# EasyEDA Pro project PC20230001.eprj

# Schematic Schematic
Create Date: 2023-11-23; Page Name: P1; Project Name: PC20230001; Schematic Name: Schematic; Update Date: 2023-12-27; Company: Alencar Tecnologia da Amazônia LTDA.; Drawed: Márcio Alencar; Page Size: A4; Part Number: JLCPCB-001; Reviewed: Juan Colonna; Version: V3.0
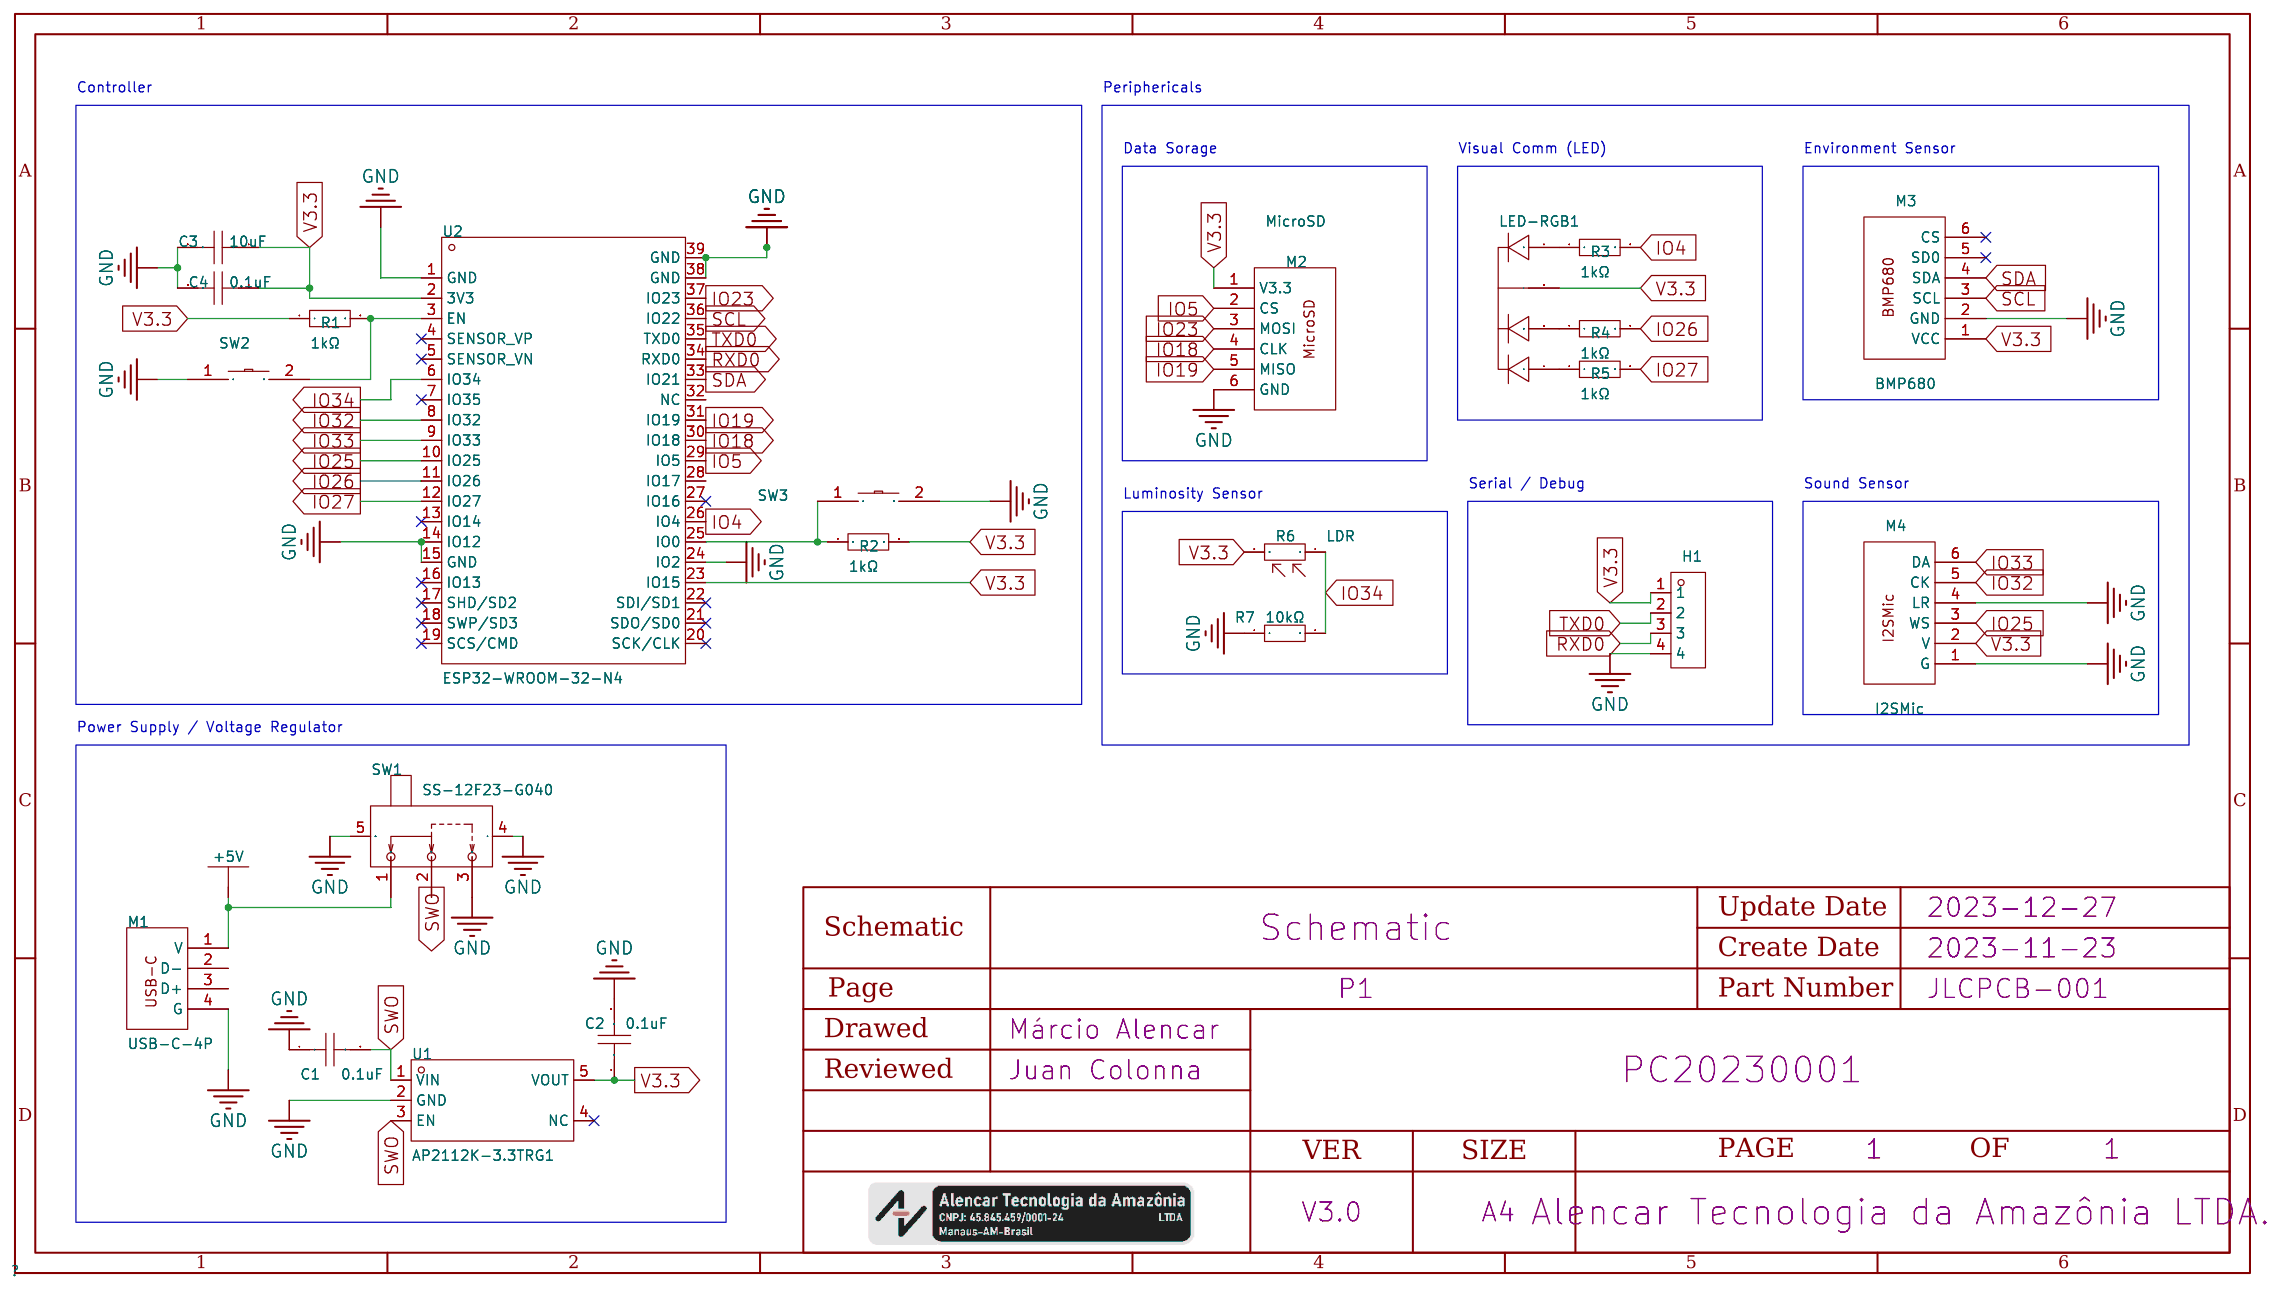
[diagram p0: schematic sheet]

## Parts
C1  0.1uF  [C0805]
C2  0.1uF  [C0805]
C3  10uF  [C0805]
C4  0.1uF  [C0805]
H1  -  [HDR-TH_4P-P2.54-V-F]
LED-RGB1  LED-RGB 共阴 插件 直径5mm  [LED-TH_4P-BD5.8-P1.30]
M1  USB-C-4P  [USB-C-4P_SMD]
M2  MicroSD  [MicroSD_SMD]
M3  BMP680  [BMP680_SMD]
M4  I2SMic  [I2SMic_SMD]
R1  1kΩ  [RES-TH_BD1.8-L3.2-P7.20-D0.4]
R2  1kΩ  [RES-TH_BD1.8-L3.2-P7.20-D0.4]
R3  1kΩ  [RES-TH_BD1.8-L3.2-P7.20-D0.4]
R4  1kΩ  [RES-TH_BD1.8-L3.2-P7.20-D0.4]
R5  1kΩ  [RES-TH_BD1.8-L3.2-P7.20-D0.4]
R6  LDR  [RES-TH_L7.0-W5.9-P5.00-D0.5]
R7  10kΩ  [RES-TH_BD1.8-L3.2-P7.20-D0.4]
SW1  SS-12F23-G040  [SW-TH_SS-12F23-G040]
SW2  TS-1101-C-W  [SW-SMD_L6.0-W3.3-LS8.0]
SW3  TS-1101-C-W  [SW-SMD_L6.0-W3.3-LS8.0]
U1  AP2112K-3.3TRG1  [SOT-25-5_L2.9-W1.6-P0.95-LS2.8-BL]
U2  ESP32-WROOM-32-N4  [WIFIM-SMD_ESP32-WROOM-32-N4]

## Library data of the parts
C1-C4 = CAP_0805: Supplier Footprint: 0805
H1 = HDR-F_2.54_1x4P: Supplier Footprint: Through
LED-RGB1 = LED-RGB 共阴 插件 直径5mm: Supplier Part: C9900015469; Supplier Footprint: LED_RGB; JLCPCB Part Class: Extended Part; Datasheet: https://atta.szlcsc.comnull; Supplier: LCSC
M1 = USB-C-4P
M2 = MiroSD
M3 = BMP680
M4 = I2SMicrophone
R1-R5 R7 = Res_AXIAL-1/8W: Supplier Footprint: Through
R6 = GL7549: Spectral Peak:- Applied Voltage:- Rise Time:- Fall Time:- Illuminated Resistance @ 10Lux:- Illuminated Resistance @ 10Lux:- Dark Resistance:- Operating Temperature:- Operating Temperature:-; LCSC Part Name: 光敏电阻; Supplier Part: C559384; Manufacturer: JCHL(晶创和立); Supplier Footprint: 插件,P=5mm; JLCPCB Part Class: Extended Part; Datasheet: https://atta.szlcsc.com/upload/public/pdf/source/20200525/C559384_342228AE8878A7B9A17BF0FFA6DF3E3D.pdf; Supplier: LCSC
SW1 = SS-12F23-G040: Current Rating (DC):1A Voltage Rating (DC):24V Circuit:SPDT Mounting Style:Lying Mechanical Life:10000次 Actuator Color:Black Actuator Style:Rectangular columnar Pin Style:PCPin Operating Temperature:-25℃~+70℃ Operating Temperature:-25℃~+70℃ Switch Length:; LCSC Part Name: 柄长4mm 卧插两档 滑动开关; Supplier Part: C2848932; Manufacturer: G-Switch(品赞); Supplier Footprint: 插件; JLCPCB Part Class: Extended Part; Datasheet: https://atta.szlcsc.com/upload/public/pdf/source/20210728/C2848932_6371EF66D27F33FC1DE94FF4D960D2AE.pdf; Supplier: LCSC; Current Rating (DC): 1A; Voltage Rating (DC): 24V; Circuit: SPDT; Mounting Style: Lying; Mechanical Life: 10000次; Actuator Color: Black; Actuator Style: Rectangular columnar; Pin Style: PCPin; Operating Temperature: -25℃~+70℃; Switch Length: 13.2mm; Switch Width: 5.8mm; Switch Height: 10.85mm
SW2 SW3 = TS-1101-C-W: Contact Current:50mA Voltage Rating (AC):- Voltage Rating (DC):12V Power Rating:- Insulation Resistance:- Circuit:SPST Mounting Style:Brick nogging Actuator Style:Rectangle button Actuator/Cap Color:白色带淡绿 With Lamp:No Operating Force:260gf Mechanical Life; LCSC Part Name: 立贴 6*3.6*2.5mm 轻触开关 一型3*6*2.5有白ZD b拉伸白色带淡绿按键 卷装; Supplier Part: C318938; Manufacturer: XKB Connectivity(中国星坤); Supplier Footprint: SMD; JLCPCB Part Class: Extended Part; Datasheet: https://atta.szlcsc.com/upload/public/pdf/source/20200227/C318938_C2E53B1EEDE37D980A33616AC086DE53.pdf; Supplier: LCSC; Contact Current: 50mA; Voltage Rating (DC): 12V; Circuit: SPST; Mounting Style: Brick nogging; Actuator Style: Rectangle button; Actuator/Cap Color: 白色带淡绿; With Lamp: No; Operating Force: 260gf; Mechanical Life: 50000次; Operating Temperature: -30℃~+85℃; Switch Length: 6mm; Switch Width: 3.6mm; Switch Height: 2.5mm; Strike Gundam: NO
U1 = AP2112K-3.3TRG1: Output Type: Output Polarity:Positive Number of Outputs:1 Maximum Input Voltage:6V Output Voltage:3.3V~3.3V Output Voltage:3.3V~3.3V Dropout Voltage:400mV@(600mA) Output Current:600mA Power Supply Rejection Ratio (PSRR):65dB@(100Hz,1kHz); Supplier Part: C51118; Manufacturer: DIODES(美台); Supplier Footprint: SOT-25-5; JLCPCB Part Class: Extended Part; Datasheet: https://atta.szlcsc.com/upload/public/pdf/source/20171221/C51118_15138312998391195590.pdf; Supplier: LCSC; Output Polarity: Positive; Number of Outputs: 1; Maximum Input Voltage: 6V; Output Voltage: 3.3V~3.3V; Dropout Voltage: 400mV@(600mA); Output Current: 600mA; Power Supply Rejection Ratio (PSRR): 65dB@(100Hz,1kHz)
U2 = ESP32-WROOM-32-N4: LCSC Part Name: WiFi+蓝牙4.2+双核CPU模块; Supplier Part: C82899; Manufacturer: ESPRESSIF(乐鑫); Supplier Footprint: SMD,18x25.5mm; JLCPCB Part Class: Extended Part; Datasheet: https://atta.szlcsc.com/upload/public/pdf/source/20210719/C82899_2D52724B6FAFABC419BCF308C5944296.pdf; Supplier: LCSC

## Nets
+5V: M1.1(V) SW1.1
GND: C1.1 C2.2 C3.2 C4.2 H1.4 M1.4(G) M2.6(GND) M3.2(GND) M4.1(G) M4.4(LR) R7.1 SW1.3 SW1.4 SW1.5 SW2.1 SW3.2 U1.2(GND) U2.1(GND) U2.14(IO12) U2.15(GND) U2.24(IO2) U2.38(GND) U2.39(GND)
V3.3: C2.1 C3.1 C4.1 H1.1 LED-RGB1.2(-) M2.1(V3.3) M3.1(VCC) M4.2(V) R1.1 R2.2 R6.2 U1.5(VOUT) U2.2(3V3) U2.23(IO15)
IO4: R3.2 U2.26(IO4)
IO5: M2.2(CS) U2.29(IO5)
IO18: M2.4(CLK) U2.30(IO18)
IO19: M2.5(MISO) U2.31(IO19)
IO23: M2.3(MOSI) U2.37(IO23)
IO25: M4.3(WS) U2.10(IO25)
IO26: R4.2 U2.11(IO26)
IO27: R5.2 U2.12(IO27)
IO32: M4.5(CK) U2.8(IO32)
IO33: M4.6(DA) U2.9(IO33)
IO34: R6.1 R7.2 U2.6(IO34)
RXD0: H1.3 U2.34(RXD0)
SCL: M3.3(SCL) U2.36(IO22)
SDA: M3.4(SDA) U2.33(IO21)
SWO: C1.2 SW1.2 U1.1(VIN) U1.3(EN)
TXD0: H1.2 U2.35(TXD0)
Net-(LED-RGB1-1): LED-RGB1.1 R3.1
Net-(LED-RGB1-3): LED-RGB1.3 R4.1
Net-(LED-RGB1-4): LED-RGB1.4 R5.1
Net-(R1-2): R1.2 SW2.2 U2.3(EN)
Net-(R2-1): R2.1 SW3.1 U2.25(IO0)

Not connected (* = marked no-connect by the designer): M1 2(D-) 3(D+); M3 5(SD0)* 6(CS)*; U1 4(NC)*; U2 4(SENSOR_VP)* 5(SENSOR_VN)* 7(IO35)* 13(IO14)* 16(IO13)* 17(SHD/SD2)* 18(SWP/SD3)* 19(SCS/CMD)* 20(SCK/CLK)* 21(SDO/SD0)* 22(SDI/SD1)* 27(IO16)* 28(IO17) 32(NC)

## Notes on the sheet
- Controller
- Periphericals
- Data Sorage
- Visual Comm (LED)
- Environment Sensor
- Luminosity Sensor
- Serial / Debug
- Sound Sensor
- Power Supply / Voltage Regulator

# Board PCB
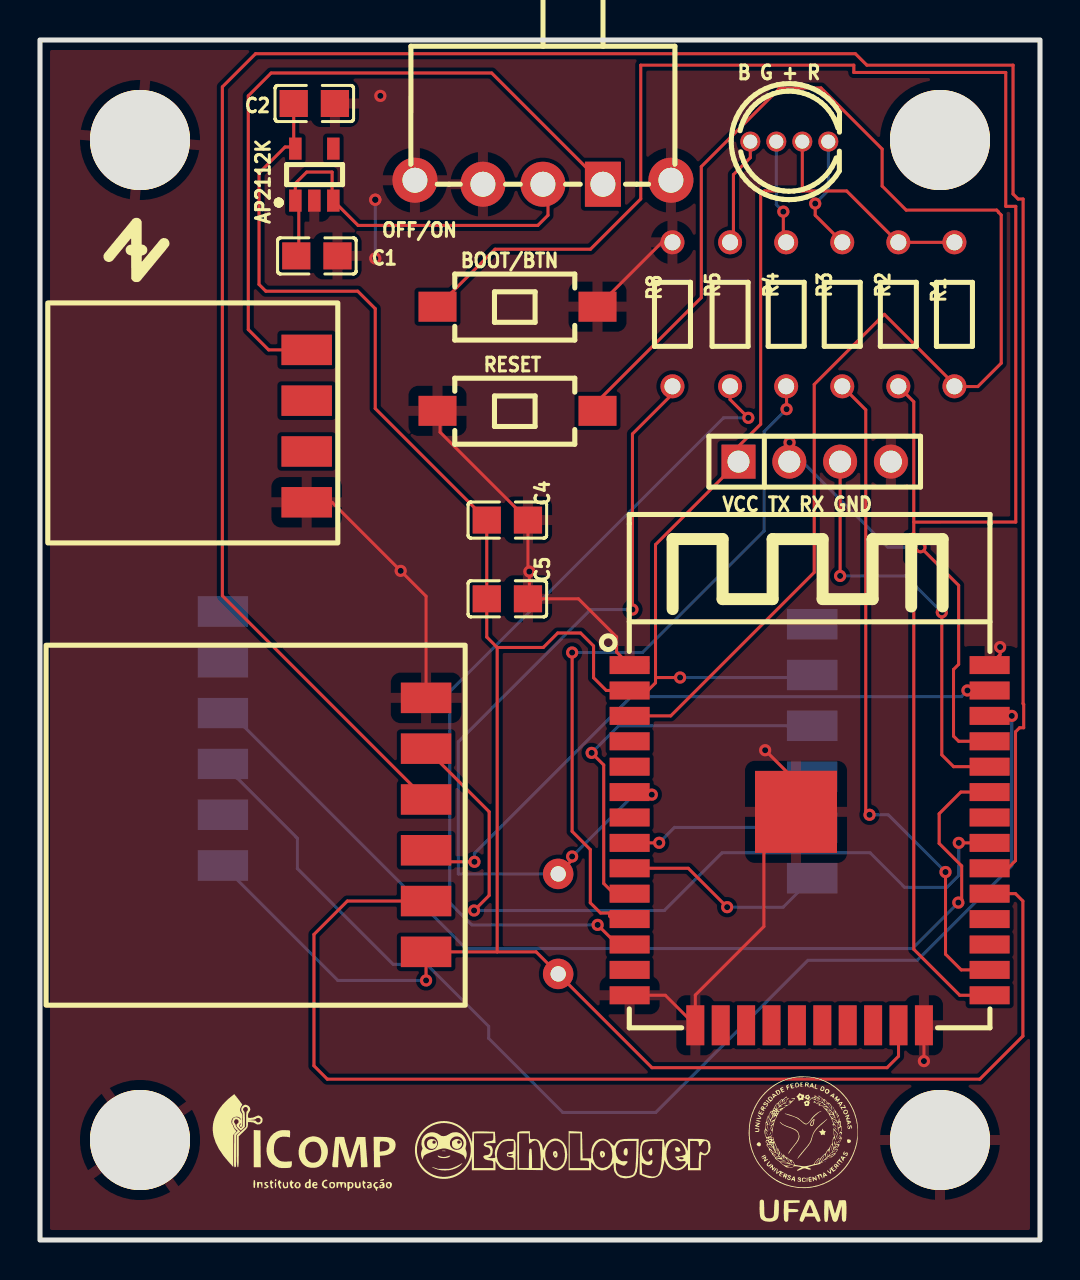
[diagram p1: board, top side]
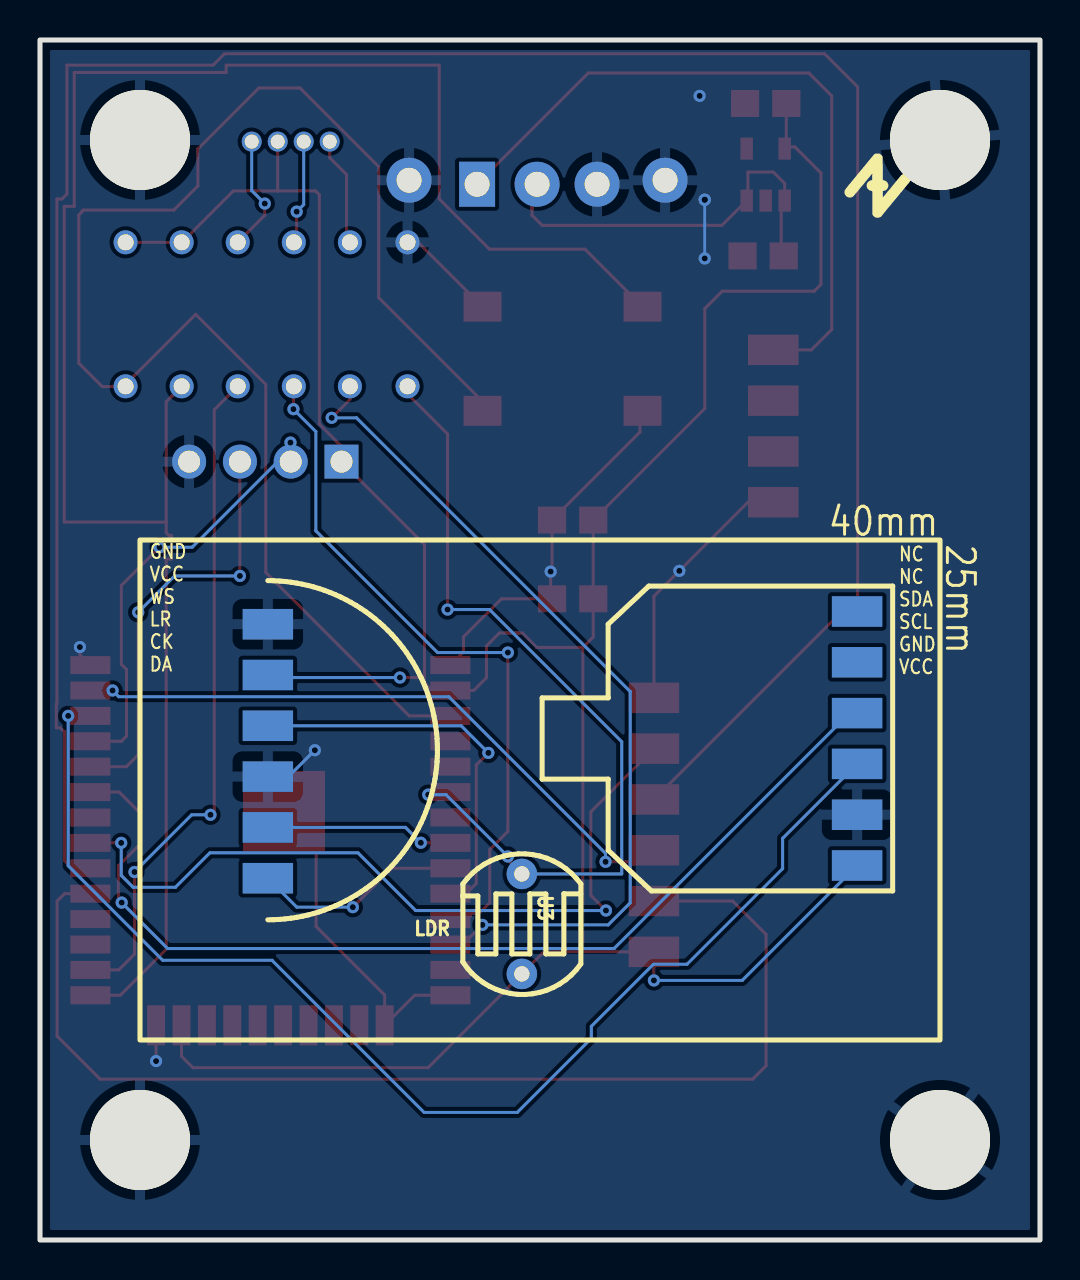
[diagram p2: board, bottom side, seen from below]

Outline 50 x 60 mm; copper layers: Top Layer, Bottom Layer. Coordinates in mm from the lower left corner of the outline.
Outline path: rectangle 0,60 50,0
Stack: Top Layer 0.035mm / Dielectric1 1.51mm FR4 er 4.5 / Bottom Layer 0.035mm

## Design rules (mm)
template: Custom Config
spacing copperThickness1oz (default): track to track 0.102, other pairs 0.152 to 0.3
spacing copperThickness2oz: track to track 0.203, other pairs 0.152 to 0.3
track width copperThickness1oz (default): min 0.152, default 0.152, max 0.152
track width copperThickness2oz: min 0.203, default 0.254, max 2.54
differential pair differentialPair (default): width min 0.127, default 0.254, max 2.54; gap min 0.152, default 0.152
via viaSize (default): diameter min 0.5, default 0.61, max 10; hole min 0.3, default 0.305, max 6.299

## Placement (name value [footprint] x y rotation side)
AP2112K  AP2112K-3.3TRG1  [SOT-25-5_L2.9-W1.6-P0.95-LS2.8-BL]  13.72 53.27 0 top
B G + R  LED-RGB 共阴 插件 直径5mm  [LED-TH_4P-BD5.8-P1.30]  37.47 54.92 0 top
BOOT/BTN  TS-1101-C-W  [SW-SMD_L6.0-W3.3-LS8.0]  23.88 46.67 0 top
C1  0.1uF  [C0805]  13.84 49.2 180 top
C2  0.1uF  [C0805]  13.72 56.83 0 top
C3  10uF  [USB-C-4P_SMD]  9.53 40.7 90 top
C4  0.1uF  [C0805]  23.37 36 0 top
C5  10uF  [C0805]  23.37 32.06 0 top
LDR  GL7549  [RES-TH_L7.0-W5.9-P5.00-D0.5]  25.91 15.8 0 bottom
NOREF  -  [Pad_e140]  45 55 0 top
NOREF#2  -  [Pad_e146]  5 5 305 top
NOREF#3  -  [Pad_e135]  5 55 355 top
NOREF#4  -  [Pad_e145]  45 5 0 top
NOREF#5  -  [I2SMic_SMD]  36.7 24.44 270 bottom
OFF/ON  SS-12F23-G040  [SW-TH_SS-12F23-G040]  25.15 52.89 180 top
R1  1kΩ  [RES-TH_BD1.8-L3.2-P7.20-D0.4]  45.72 46.28 270 top
R2  1kΩ  [RES-TH_BD1.8-L3.2-P7.20-D0.4]  42.92 46.28 90 top
R3  1kΩ  [RES-TH_BD1.8-L3.2-P7.20-D0.4]  40.11 46.28 270 top
R4  1kΩ  [RES-TH_BD1.8-L3.2-P7.20-D0.4]  37.31 46.28 270 top
R5  1kΩ  [RES-TH_BD1.8-L3.2-P7.20-D0.4]  34.5 46.28 270 top
R8  10kΩ  [RES-TH_BD1.8-L3.2-P7.20-D0.4]  31.62 46.28 270 top
RESET  TS-1101-C-W  [SW-SMD_L6.0-W3.3-LS8.0]  23.88 41.46 0 top
U1  AP2112K-3.3TRG1  [WIFIM-SMD_ESP32-WROOM-32-N4]  38.48 19.74 0 top
U3  BMP680  [BMP680_SMD]  12.06 25.08 90 bottom
U4  MicroSD  [MicroSD_SMD]  16.13 20.76 90 top
VCC TX RX GND  -  [HDR-TH_4P-P2.54-V-F]  38.74 38.92 0 top

## Footprints (pads in the part's own frame, mm; a bottom-side part is the same pattern mirrored in y, then rotated)
BMP680_SMD
  rect 1.524x2.524 smd: 1(-6.35,-2.921) 2(-3.81,-2.921) 3(-1.27,-2.921) 4(1.27,-2.921) 5(3.81,-2.921) 6(6.35,-2.921)
C0805
  rect 1.41x1.35 smd: 1(-1.03,0) 2(1.03,0)
HDR-TH_4P-P2.54-V-F
  rect 1.7x1.7 hole 1.1: 1(-3.81,0)
  round 1.7 hole 1.1: 2(-1.27,0) 3(1.27,0) 4(3.81,0)
I2SMic_SMD
  rect 1.524x2.524 smd: 1(-6.35,-1.905) 2(-3.81,-1.905) 3(-1.27,-1.905) 4(1.27,-1.905) 5(3.81,-1.905) 6(6.35,-1.905)
LED-TH_4P-BD5.8-P1.30
  round 1 hole 0.7: 1(1.95,0) 2(0.65,0) 3(-0.65,0) 4(-1.95,0)
MicroSD_SMD
  rect 1.524x2.524 smd: 1(-6.35,-3.175) 2(-3.81,-3.175) 3(-1.27,-3.175) 4(1.27,-3.175) 5(3.81,-3.175) 6(6.35,-3.175)
Pad_e135
  round 5 hole 5: 1(0,0)
Pad_e140
  round 5 hole 5: 1(0,0)
Pad_e145
  round 5 hole 5: 1(0,0)
Pad_e146
  round 5 hole 5: 1(0,0)
RES-TH_BD1.8-L3.2-P7.20-D0.4
  round 1.2 hole 0.8: 1(-3.6,0) 2(3.6,0)
RES-TH_L7.0-W5.9-P5.00-D0.5
  round 1.524 hole 0.762x0.767: 1(0,-2.5) 2(0,2.5)
SOT-25-5_L2.9-W1.6-P0.95-LS2.8-BL
  rect 0.623x1.105 smd: 1(-0.95,-1.3) 2(-0.001,-1.3) 3(0.95,-1.3) 4(0.95,1.3) 5(-0.95,1.3)
SW-SMD_L6.0-W3.3-LS8.0
  rect 1.9x1.5 smd: 1(-4,0) 2(4,0)
SW-TH_SS-12F23-G040
  rect 1.8x2.25 hole 1.25: 1(-3,0.1)
  round 2.25 hole 1.25: 2(0,0.1) 3(3,0.1) 4(6.4,-0.1) 5(-6.4,-0.1)
USB-C-4P_SMD
  rect 1.524x2.524 smd: 1(3.81,-3.81) 2(1.27,-3.81) 3(-1.27,-3.81) 4(-3.81,-3.81)
WIFIM-SMD_ESP32-WROOM-32-N4
  rect 2x0.9 smd: 1(-9,9.005) 2(-9,7.735) 3(-9,6.465) 4(-9,5.195) 5(-9,3.925) 6(-9,2.655) 7(-9,1.385) 8(-9,0.115) 9(-9,-1.155) 10(-9,-2.425) 11(-9,-3.695) 12(-9,-4.965) 13(-9,-6.235) 14(-9,-7.505) 25(9,-7.505) 26(9,-6.235) 27(9,-4.965) 28(9,-3.695) 29(9,-2.425) 30(9,-1.155) 31(9,0.115) 32(9,1.385) 33(9,2.655) 34(9,3.925) 35(9,5.195) 36(9,6.465) 37(9,7.735) 38(9,9.005)
  rect 0.9x2 smd: 15(-5.715,-9.005) 16(-4.445,-9.005) 17(-3.175,-9.005) 18(-1.905,-9.005) 19(-0.635,-9.005) 20(0.635,-9.005) 21(1.905,-9.005) 22(3.175,-9.005) 23(4.445,-9.005) 24(5.715,-9.005)
  rect 4.1x4.1 smd: 39(-0.68,1.665)

## Nets
+5V: C3.1 OFF/ON.1
GND: AP2112K.2 BOOT/BTN.2 C1.1 C2.2 C3.4 C4.2 C5.2 NOREF.1 NOREF#2.1 NOREF#3.1 NOREF#4.1 NOREF#5.1 NOREF#5.4 OFF/ON.3 OFF/ON.4 OFF/ON.5 R8.1 RESET.1 U1.1 U1.14 U1.15 U1.24 U1.38 U1.39 U3.2 U4.6 VCC TX RX GND.4
V3.3: AP2112K.5 B G + R.2 C2.1 C4.1 C5.1 LDR.2 NOREF#5.2 R1.1 R2.2 U1.2 U1.23 U3.1 U4.1 VCC TX RX GND.1
IO4: R3.2 U1.26
IO5: U1.29 U4.2
IO18: U1.30 U4.4
IO19: U1.31 U4.5
IO23: U1.37 U4.3
IO25: NOREF#5.3 U1.10
IO26: R4.2 U1.11
IO27: R5.2 U1.12
IO32: NOREF#5.5 U1.8
IO33: NOREF#5.6 U1.9
IO34: LDR.1 R8.2 U1.6
RXD0: U1.34 VCC TX RX GND.3
SCL: U1.36 U3.3
SDA: U1.33 U3.4
SWO: AP2112K.1 AP2112K.3 C1.2 OFF/ON.2
TXD0: U1.35 VCC TX RX GND.2
$1N599: BOOT/BTN.1 R2.1 U1.25
$1N874: R1.2 RESET.2 U1.3
$1N4278: B G + R.1 R3.1
$1N4302: B G + R.3 R4.1
$1N4327: B G + R.4 R5.1

Pads without a net: AP2112K 4; C3 2 3; U1 4 5 7 13 16 17 18 19 20 21 22 27 28 32; U3 5 6

## Via types
v1: diameter 0.61, hole 0.305, Top Layer to Bottom Layer, 35 vias

## Routing (per net, layer and track width the routed paths; a pad name or vN(x,y) marks a point on that pad's centre or on a via; arc(x,y) is an arc through that point)
+5V: length 35.5
  Top Layer w0.152: OFF/ON.1 22.59,58.35 11.56,58.35 10.41,57.21 10.41,45.52 11.43,44.51 C3.1
GND: length 65.4
  Top Layer w0.152: v1(36.26,24.49) 37.8,22.95 U1.39 36.19,19.8 36.19,15.68 32.77,12.25 U1.15 31.27,12.24 U1.14 ; C3.4 14.6,36.89 v1(18.03,33.46) 19.3,32.19 U4.6 ; U1.38 48.01,29.27 v1(48.01,29.65) ; R8.1 31.09,49.88 BOOT/BTN.2 ; U1.1 28.83,29.4 28.83,30.16 26.92,32.06 C5.2 24.47,32.13 v1(24.47,33.42) 24.4,33.49 C4.2 20,40.39 20,41.46 ; U1.24 v1(44.2,8.95)
  Bottom Layer w0.152: v1(16.76,52.01) v1(16.76,49.08) ; v1(36.26,24.49) 37.58,23.17 NOREF#5.4
  vias: v1(17.02,57.21)
V3.3: length 151.2
  Top Layer w0.152: 38.12,52.45 B G + R.2 ; 38.12,52.45 40.33,52.45 42.9,49.88 R2.2 R1.1 ; 38.12,52.45 36.22,52.45 36.03,52.26 36.03,40.79 34.93,39.68 VCC TX RX GND.1 30.78,34.77 30.78,28.12 ; 22.86,14.41 U4.1 v1(19.3,12.98) ; 22.86,14.41 24.81,14.41 LDR.2 30.6,8.62 42.35,8.62 42.93,9.19 U1.23 ; 22.86,14.41 22.86,29.63 ; 30.78,28.12 30.78,27.86 30.39,27.48 U1.2 28.31,27.48 27.68,28.11 27.68,29.7 27.03,30.35 25.88,30.35 25.16,29.63 22.86,29.63 ; 30.78,28.12 v1(32,28.12) ; C2.1 12.69,54.65 ; 12.69,54.65 12.25,54.65 10.95,53.35 10.95,47.78 11.29,47.44 15.89,47.44 16.76,46.57 16.76,41.57 C4.1 C5.1 22.34,30.15 22.86,29.63 ; 12.69,54.65 AP2112K.5
  Bottom Layer w0.152: 9.14,18.72 14.89,12.98 v1(19.3,12.98) ; v1(32,28.12) 38.48,28.12 NOREF#5.2
IO4: length 33.6
  Top Layer w0.152: v1(41.48,21.26) 41.29,21.45 41.29,41.51 R3.2 ; v1(45.28,18.4) 45.28,14.29 46.06,13.51 U1.26
  Bottom Layer w0.152: v1(45.28,18.4) 42.41,21.26 v1(41.48,21.26)
IO5: length 58
  Top Layer w0.152: U1.29 48.77,17.32 49.14,16.95 49.14,10.19 46.99,8.04 14.37,8.04 13.7,8.71 13.7,15.28 15.37,16.95 U4.2
IO18: length 122.2
  Top Layer w0.152: U1.30 48.39,18.59 48.78,18.97 48.78,25.41 48.98,25.61 49.18,25.61 49.18,26.79 49.16,26.82 49.16,52.05 48.9,52.05 48.65,52.3 48.65,58.74 41.34,58.74 40.77,59.31 10.78,59.31 9.12,57.65 9.12,32.21 U4.4
IO19: length 39.3
  Top Layer w0.152: U4.5 22.46,21.41 22.46,17.23 v1(21.7,16.47) ; v1(45.94,19.86) U1.31
  Bottom Layer w0.152: v1(21.7,16.47) 31.22,16.47 34.1,19.36 41.5,19.36 43.23,17.64 45.34,17.64 45.94,18.23 v1(45.94,19.86)
IO23: length 32.2
  Top Layer w0.152: U4.3 19.88,18.91 v1(21.72,18.91) ; U1.37 v1(46.37,27.48)
  Bottom Layer w0.152: v1(46.37,27.48) 46.06,27.17 29.56,27.17 21.72,19.33 v1(21.72,18.91)
IO25: length 19.9
  Top Layer w0.152: U1.10 28.7,17.32 28.19,17.83 28.19,23.75 v1(27.58,24.36)
  Bottom Layer w0.152: NOREF#5.3 28.94,25.71 v1(27.58,24.36)
IO26: length 35.1
  Top Layer w0.152: U1.11 28.63,16.05 28.48,16.2 28.48,16.35 28.02,16.35 27.51,16.86 27.51,19.52 26.61,20.43 v1(26.61,29.37) ; R4.2 37.33,42.66 v1(37.33,41.54)
  Bottom Layer w0.152: v1(26.61,29.37) 30.12,29.37 36.21,35.46 36.21,40.42 v1(37.33,41.54)
IO27: length 43
  Top Layer w0.152: U1.12 28.86,14.78 v1(27.88,15.75) ; R5.2 34.5,42.02 v1(35.42,41.11)
  Bottom Layer w0.152: v1(35.42,41.11) 34.18,41.11 20.49,27.42 20.49,16.86 21.59,15.75 v1(27.88,15.75)
IO32: length 9.4
  Top Layer w0.152: U1.8 30.95,19.86 v1(30.96,19.86)
  Bottom Layer w0.152: NOREF#5.5 31.73,20.63 v1(30.96,19.86)
IO33: length 10.5
  Top Layer w0.152: v1(34.36,16.64) 32.41,18.59 U1.9
  Bottom Layer w0.152: NOREF#5.6 37.16,16.64 v1(34.36,16.64)
IO34: length 42.6
  Top Layer w0.152: v1(26.61,19.17) 26.61,19 LDR.1 ; R8.2 31.62,42.3 29.62,40.3 v1(29.62,31.52) ; v1(30.59,22.27) 29.61,22.27 U1.6
  Bottom Layer w0.152: v1(30.59,22.27) 29.7,22.27 v1(26.61,19.17) ; v1(29.62,31.52) 27.52,31.52 20.91,24.91 20.91,18.3 LDR.1
RXD0: length 21.3
  Top Layer w0.152: v1(45.09,31.39) 45.09,24.26 45.68,23.67 U1.34 ; v1(40,33.2) 40,38.92
  Bottom Layer w0.152: v1(45.09,31.39) 43.27,33.2 v1(40,33.2)
SCL: length 61.6
  Top Layer w0.152: U1.36 v1(48.59,26.21)
  Bottom Layer w0.152: v1(48.59,26.21) 48.59,18.71 43.86,13.98 38.4,13.98 30.79,6.38 26.14,6.38 22.43,10.08 22.43,10.68 19.33,13.79 17.65,13.79 12.87,18.57 12.87,20.08 U3.3
SDA: length 50.5
  Top Layer w0.152: v1(45.92,16.87) 46.08,17.04 46.08,18.7 44.96,19.83 44.96,21.31 46.04,22.4 U1.33
  Bottom Layer w0.152: U3.4 9.52,26.34 21.29,14.57 43.62,14.57 v1(45.92,16.87)
SWO: length 20
  Top Layer w0.152: OFF/ON.2 25.4,52.53 25.4,51.24 24.89,50.73 15.91,50.73 14.6,52.03 14.6,53.4 13.34,53.4 12.77,52.83 12.77,51.97 12.94,51.8 12.94,49.59
TXD0: length 22.1
  Top Layer w0.152: VCC TX RX GND.2 37.48,38.93 v1(37.48,39.87) ; U1.35 45.93,24.94 45.68,25.19 45.68,28.53 45.93,28.78 45.93,32.73 v1(44.02,34.64)
  Bottom Layer w0.152: v1(44.02,34.64) 42.39,34.64 37.48,39.55 v1(37.48,39.87)
$1N599: length 99.4
  Top Layer w0.152: BOOT/BTN.1 22.75,49.54 27.52,49.54 30.04,52.05 30.04,58.74 40.69,58.74 40.69,58.38 48.29,58.38 48.29,51.68 48.79,51.68 48.79,35.9 43.69,35.89 ; 43.69,35.89 43.69,35.36 43.56,35.23 43.43,35.23 43.43,34.04 43.69,34.04 43.69,14.53 45.99,12.24 U1.25 ; 43.69,35.89 43.69,41.91 R2.1
$1N874: length 76.5
  Top Layer w0.152: 28,41.46 28,42.06 33.06,47.12 33.06,53.67 37,57.6 39.05,57.6 42.11,54.55 42.11,52.7 43.31,51.5 47.83,51.5 47.92,51.41 47.92,51.39 48.06,51.25 48.06,43.84 46.89,42.67 45.73,42.67 R1.2 45.72,42.78 42.22,46.28 38.71,42.78 38.71,33.38 31.54,26.21 U1.3
$1N4278: length 5.9
  Top Layer w0.152: R3.1 38.76,51.24 v1(38.76,51.82)
  Bottom Layer w0.152: B G + R.1 39.41,52.47 v1(38.76,51.82)
$1N4302: length 5.2
  Top Layer w0.152: R4.1 37.17,50.03 v1(37.17,51.42)
  Bottom Layer w0.152: B G + R.3 36.81,51.77 v1(37.17,51.42)
$1N4327: length 5.5
  Top Layer w0.152: R5.1 34.67,50.05 34.67,53.27 35.51,54.11 B G + R.4

## Copper pours and planes (outline as drawn; the poured copper is in the pictures)
GND on Top Layer: 0,60 50,60 50,0 0,0
GND on Bottom Layer: 0,60 50,60 50,0 0,0

## Text on the board
Bottom Silkscreen Layer: NC / NC / SDA / SCL / GND / VCC | GND / VCC / WS / LR / CK / DA | 40mm | 25mm
